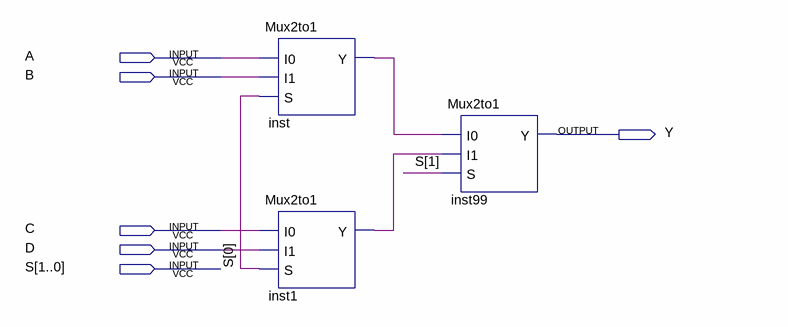
[diagram p0: schematic sheet]
// Quartus schematic Mux4to1.bdf as structural Verilog: 3 symbols, 6 pins
module Mux4to1 (
  input  A,
  input  B,
  input  C,
  input  D,
  input  [1:0] S,
  output Y
);

  wire inst1_y, inst_y;

  Mux2to1 inst (.I0(A), .I1(B), .S(S[0]), .Y(inst_y));
  Mux2to1 inst1 (.I0(C), .I1(D), .S(S[0]), .Y(inst1_y));
  Mux2to1 inst99 (.I0(inst_y), .I1(inst1_y), .S(S[1]), .Y(Y));
endmodule
